# EAGLE schematic edu (EAGLE 7.6.0)

## Sheet 1 of 2
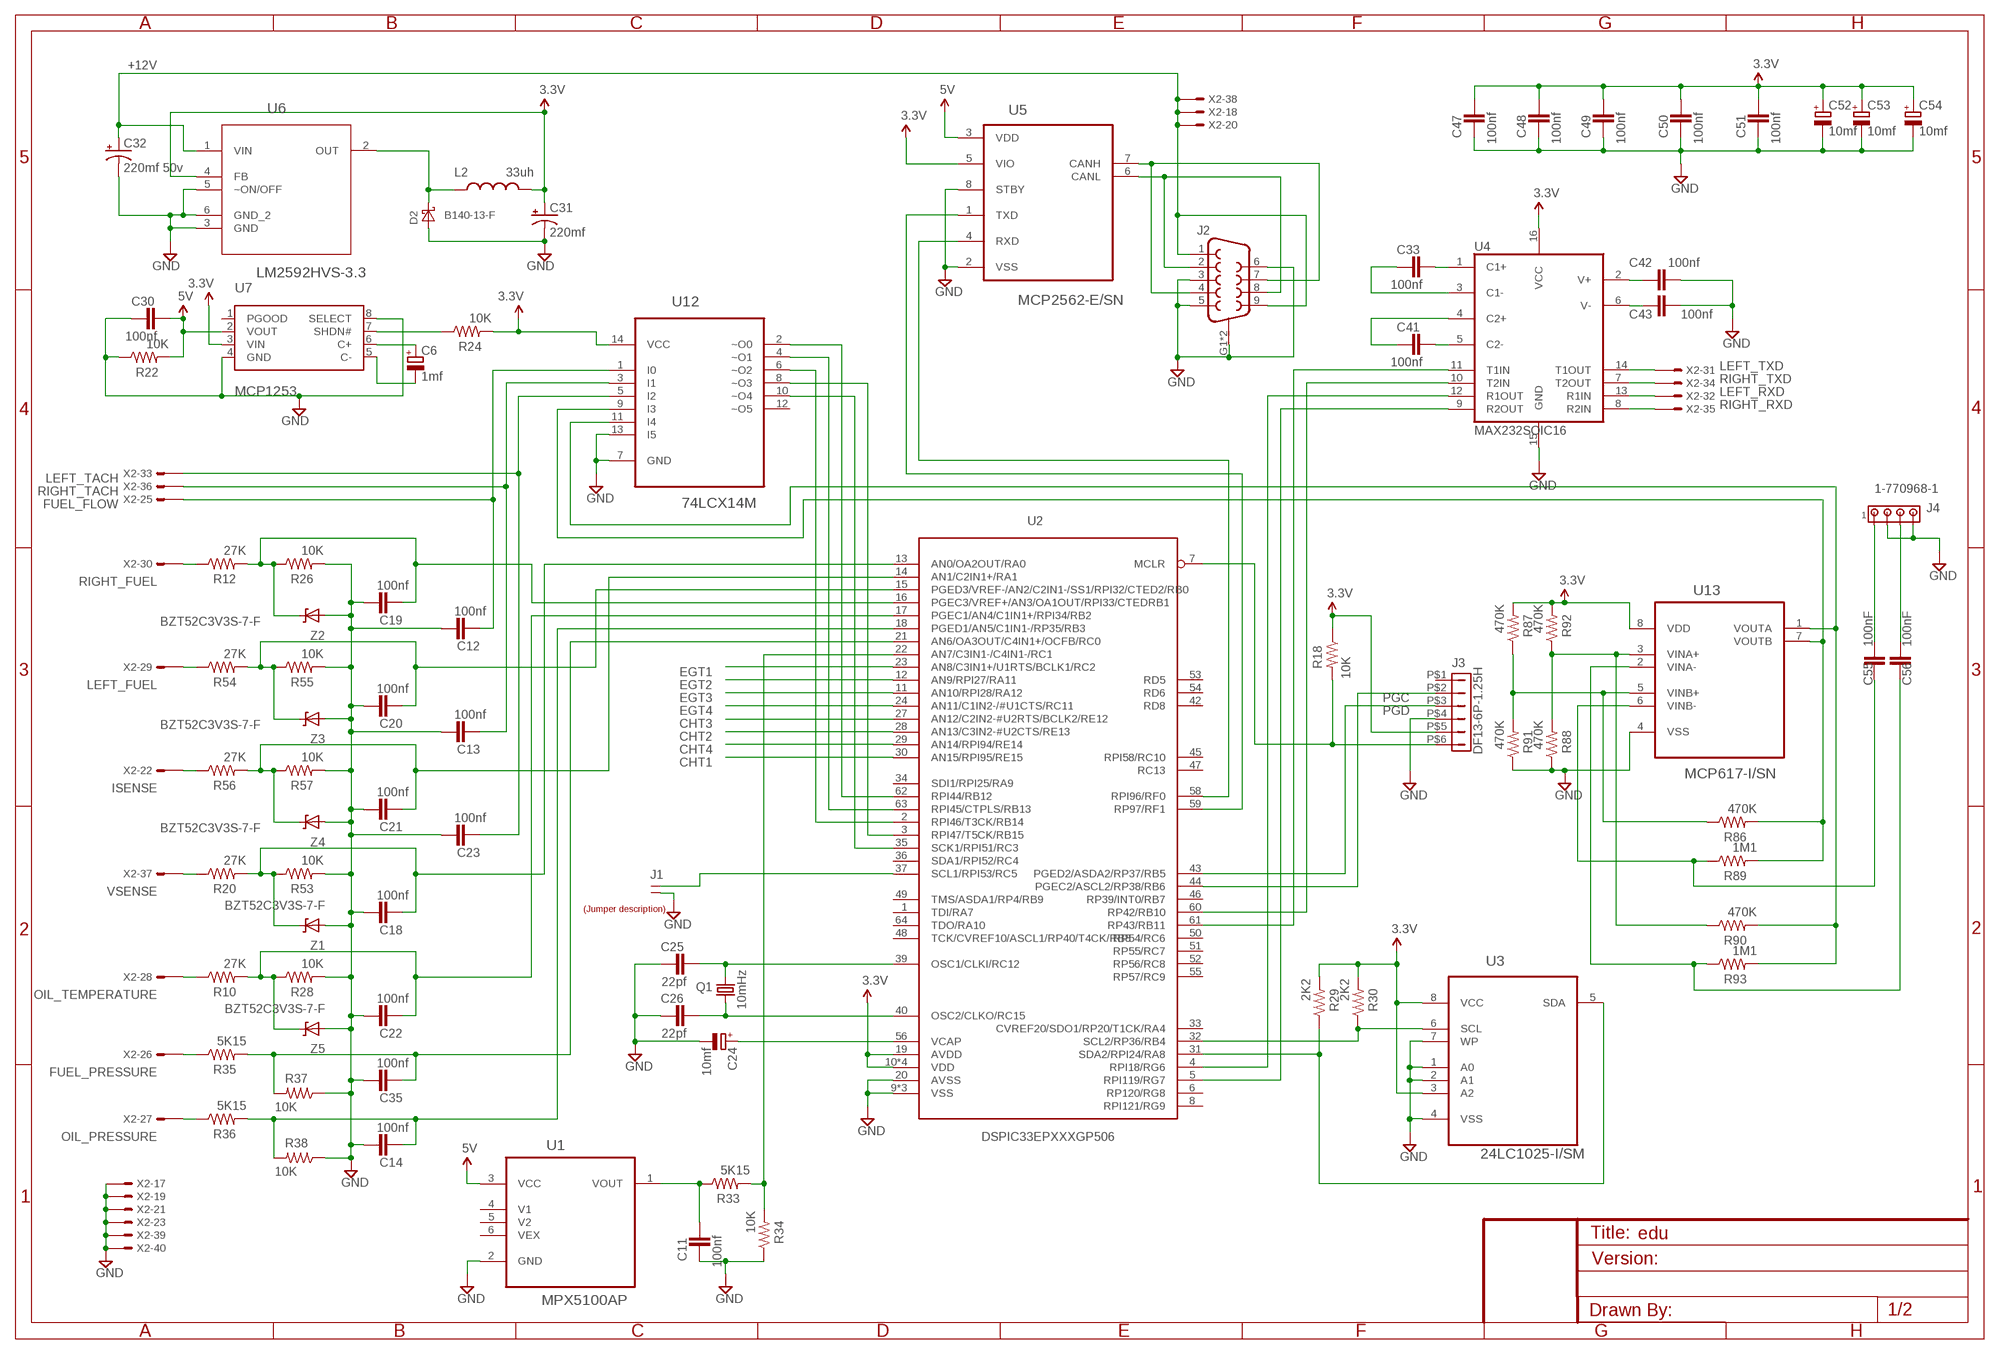
[diagram p0: schematic, sheet 1]

### Parts
C6  1mf  CAPACITOR_POL-SMC_A  [SMC_A]
C11  100nf  CAPACITOR_NPOL-0805  [C805]
C12  100nf  CAPACITOR_NPOL-0805  [C805]
C13  100nf  CAPACITOR_NPOL-0805  [C805]
C14  100nf  CAPACITOR_NPOL-0805  [C805]
C18  100nf  CAPACITOR_NPOL-0805  [C805]
C19  100nf  CAPACITOR_NPOL-0805  [C805]
C20  100nf  CAPACITOR_NPOL-0805  [C805]
C21  100nf  CAPACITOR_NPOL-0805  [C805]
C22  100nf  CAPACITOR_NPOL-0805  [C805]
C23  100nf  CAPACITOR_NPOL-0805  [C805]
C24  10mf  CAPACITOR_POL-SMC_A  [SMC_A]
C25  22pf  CAPACITOR_NPOL-0805  [C805]
C26  22pf  CAPACITOR_NPOL-0805  [C805]
C30  100nf  CAPACITOR_NPOL-0805  [C805]
C31  220mf  CAP_POL7343  [EIA7343]
C32  220mf 50v  CAP_POL7343  [EIA7343]
C33  100nf  CAPACITOR_NPOL-0805  [C805]
C35  100nf  CAPACITOR_NPOL-0805  [C805]
C41  100nf  CAPACITOR_NPOL-0805  [C805]
C42  100nf  CAPACITOR_NPOL-0805  [C805]
C43  100nf  CAPACITOR_NPOL-0805  [C805]
C47  100nf  CAPACITOR_NPOL-0805  [C805]
C48  100nf  CAPACITOR_NPOL-0805  [C805]
C49  100nf  CAPACITOR_NPOL-0805  [C805]
C50  100nf  CAPACITOR_NPOL-0805  [C805]
C51  100nf  CAPACITOR_NPOL-0805  [C805]
C52  10mf  CAPACITOR_POL-SMC_A  [SMC_A]
C53  10mf  CAPACITOR_POL-SMC_A  [SMC_A]
C54  10mf  CAPACITOR_POL-SMC_A  [SMC_A]
C55  100nF  CAP1812  [1812]
C56  100nF  CAP1812  [1812]
D2  B140-13-F  DIODE-SCHOTTKY-SMA  [SMA]
J1  M20-9770246  JUMPER-1X2  [JUMPER-1X2]
J2  DB9FEMALE  [DB9]
J3  DF13-6P-1.25H  [DF13A-6P-1.25H]
J4  1-770968-1  [1-770968-1]
L2  33uh  INDUCTOR  [1812]
Q1  10mHz  CRYSTALHC49S  [HC49/S]
R10  27K  RESISTOR0603-RES  [0603-RES]
R12  27K  RESISTOR0603-RES  [0603-RES]
R18  10K  RESISTOR0603-RES  [0603-RES]
R20  27K  RESISTOR0603-RES  [0603-RES]
R22  10K  RESISTOR0603-RES  [0603-RES]
R24  10K  RESISTOR0603-RES  [0603-RES]
R26  10K  RESISTOR0603-RES  [0603-RES]
R28  10K  RESISTOR0603-RES  [0603-RES]
R29  2K2  RESISTOR0603-RES  [0603-RES]
R30  2K2  RESISTOR0603-RES  [0603-RES]
R33  5K15  RESISTOR0603-RES  [0603-RES]
R34  10K  RESISTOR0603-RES  [0603-RES]
R35  5K15  RESISTOR0603-RES  [0603-RES]
R36  5K15  RESISTOR0603-RES  [0603-RES]
R37  10K  RESISTOR0603-RES  [0603-RES]
R38  10K  RESISTOR0603-RES  [0603-RES]
R53  10K  RESISTOR0603-RES  [0603-RES]
R54  27K  RESISTOR0603-RES  [0603-RES]
R55  10K  RESISTOR0603-RES  [0603-RES]
R56  27K  RESISTOR0603-RES  [0603-RES]
R57  10K  RESISTOR0603-RES  [0603-RES]
R86  470K  RESISTOR0603-RES  [0603-RES]
R87  470K  RESISTOR0603-RES  [0603-RES]
R88  470K  RESISTOR0603-RES  [0603-RES]
R89  1M1  RESISTOR0603-RES  [0603-RES]
R90  470K  RESISTOR0603-RES  [0603-RES]
R91  470K  RESISTOR0603-RES  [0603-RES]
R92  470K  RESISTOR0603-RES  [0603-RES]
R93  1M1  RESISTOR0603-RES  [0603-RES]
U1  MPX5100AP  [FREESCALE_CASE_867B-04]
U2  DSPIC33EPXXXGP506  [TQFP64-10X10]
U3  24LC1025-I/SM  [SOIC8-N_MC]
U4  MAX232SOIC16  [SO016]
U5  MCP2562-E/SN  [SOIC-8N]
U6  LM2592HVS-3.3  LM2592HVS-5.0  [TO170P1435X457-5N]
U7  MCP1253  [MSOP8]
U12  74LCX14M  [SOIC127P600X175-14N]
U13  MCP617-I/SN  [SOIC127P600X175-8N]
U$5  LABEL_JUMPER_1X2  [JUMP2_DESC]
X2  057-040-1  [057-040-1]
Z1  BZT52C3V3S-7-F  DIODE-ZENER-BZT52  [SOD-323]
Z2  BZT52C3V3S-7-F  DIODE-ZENER-BZT52  [SOD-323]
Z3  BZT52C3V3S-7-F  DIODE-ZENER-BZT52  [SOD-323]
Z4  BZT52C3V3S-7-F  DIODE-ZENER-BZT52  [SOD-323]
Z5  BZT52C3V3S-7-F  DIODE-ZENER-BZT52  [SOD-323]

### Nets
3.3V: C31.A(+) C47.1 C48.1 C49.1 C50.1 C51.1 C52.+ C53.+ C54.+ J3.P$5 L2.2 R18.1 R24.2 R29.2 R30.2 R87.2 R92.2 U2.10(VDD) U2.19(AVDD) U2.26(VDD) U2.38(VDD) U2.57(VDD) U3.3(A2) U3.8(VCC) U4.16(VCC) U5.5(VIO) U6.4(FB) U7.3(VIN) U12.14(VCC) U13.8(VDD) ; also sheet 2
5V: C30.1 R22.2 U1.3(VCC) U5.3(VDD) U7.2(VOUT)
!MCLR: J3.P$6 R18.2 U2.7(MCLR)
#FUEL_FLOW: U2.62(RPI44/RB12) U12.2(~O0)
#LEFT_TACH: U2.2(RPI46/T3CK/RB14) U12.6(~O2)
#RIGHT_TACH: U2.63(RPI45/CTPLS/RB13) U12.4(~O1)
+12V: C32.A(+) J2.1 J2.9 U6.1(VIN) X2.18 X2.20 X2.38
CANH: J2.4 J2.7 U5.7(CANH)
CANL: J2.2 J2.8 U5.6(CANL)
CHT1: U2.30(AN15/RPI95/RE15) ; also sheet 2
CHT2: U2.28(AN13/C3IN2-#U2CTS/RE13) ; also sheet 2
CHT3: U2.27(AN12/C2IN2-#U2RTS/BCLK2/RE12) ; also sheet 2
CHT4: U2.29(AN14/RPI94/RE14) ; also sheet 2
EGT1: U2.23(AN8/C3IN1+/U1RTS/BCLK1/RC2) ; also sheet 2
EGT2: U2.12(AN9/RPI27/RA11) ; also sheet 2
EGT3: U2.11(AN10/RPI28/RA12) ; also sheet 2
EGT4: U2.24(AN11/C1IN2-/#U1CTS/RC11) ; also sheet 2
FUEL_FLOW: C12.2 U12.1(I0) X2.25
FUEL_PRESSURE: R35.1 X2.26
GND: C11.2 C12.1 C13.1 C14.1 C18.1 C19.1 C20.1 C21.1 C22.1 C23.1 C24.- C25.2 C26.2 C30.2 C31.C(-) C32.C(-) C35.1 C42.1 C43.1 C47.2 C48.2 C49.2 C50.2 C51.2 C52.- C53.- C54.- D2.A J1.2 J2.3 J2.5 J2.6 J2.G1(SHIELD) J2.G2(SHIELD) J3.P$4 J4.P$2 J4.P$4 R22.1 R26.2 R28.2 R34.1 R37.1 R38.1 R53.2 R55.2 R57.2 R88.1 R91.1 U1.2(GND) U2.9(VSS) U2.20(AVSS) U2.25(VSS) U2.41(VSS) U3.1(A0) U3.2(A1) U3.4(VSS) U3.7(WP) U4.15(GND) U5.2(VSS) U5.8(STBY) U6.3(GND) U6.5(~ON/OFF) U6.6(GND_2) U7.4(GND) U7.8(SELECT) U12.7(GND) U12.13(I5) U13.4(VSS) X2.17 X2.19 X2.21 X2.23 X2.39 X2.40 Z1.2(A) Z2.2(A) Z3.2(A) Z4.2(A) Z5.2(A) ; also sheet 2
ISENSE: R56.1 X2.22
LEFT_FUEL: R54.1 X2.29
LEFT_RXD: U4.13(R1IN) X2.32
LEFT_TACH: C23.2 U12.5(I2) X2.33
LEFT_TXD: U4.14(T1OUT) X2.31
N$2: R24.1 U7.7(SHDN#)
N$4: C18.2 R20.2 R53.1 U2.13(AN0/OA2OUT/RA0) Z1.1(C)
N$5: C33.1 U4.1(C1+)
N$6: C33.2 U4.3(C1-)
N$7: C41.2 U4.4(C2+)
N$8: C22.2 R10.2 R28.1 U2.17(PGEC1/AN4/C1IN1+/RPI34/RB2) Z5.1(C)
N$9: C41.1 U4.5(C2-)
N$10: C42.2 U4.2(V+)
N$11: C43.2 U4.6(V-)
N$12: D2.C L2.1 U6.2(OUT)
N$13: R33.2 R34.2 U2.22(AN7/C3IN1-/C4IN1-/RC1)
N$14: C35.2 R35.2 R37.2 U2.21(AN6/OA3OUT/C4IN1+/OCFB/RC0)
N$15: C14.2 R36.2 R38.2 U2.18(PGED1/AN5/C1IN1-/RP35/RB3)
N$16: C25.1 Q1.2 U2.39(OSC1/CLKI/RC12)
N$21: C55.2 J4.P$1
N$22: C56.2 J4.P$3
N$28: R86.2 R89.2 U12.9(I3) U13.7(VOUTB)
N$29: C55.1 R89.1 U13.6(VINB-)
N$30: C56.1 R93.1 U13.2(VINA-)
N$31: C24.+ U2.56(VCAP)
N$32: R90.2 R93.2 U12.11(I4) U13.1(VOUTA)
N$33: U2.3(RPI47/T5CK/RB15) U12.8(~O3)
N$34: U2.35(SCK1/RPI51/RC3) U12.10(~O4)
N$35: J1.1 U2.37(SCL1/RPI53/RC5)
N$37: C6.- U7.5(C-)
N$38: C6.+ U7.6(C+)
N$39: R30.1 U2.32(SCL2/RP36/RB4) U3.6(SCL)
N$40: R88.2 R90.1 R92.1 U13.3(VINA+)
N$41: R29.1 U2.31(SDA2/RPI24/RA8) U3.5(SDA)
N$42: C19.2 R12.2 R26.1 U2.16(PGEC3/VREF+/AN3/OA1OUT/RPI33/CTEDRB1) Z2.1(C)
N$43: C20.2 R54.2 R55.1 U2.15(PGED3/VREF-/AN2/C2IN1-/SS1/RPI32/CTED2/RB0) Z3.1(C)
N$44: C21.2 R56.2 R57.1 U2.14(AN1/C2IN1+/RA1) Z4.1(C)
N$45: U2.59(RP97/RF1) U5.1(TXD)
N$46: U2.61(RP43/RB11) U4.11(T1IN)
N$47: U2.60(RP42/RB10) U4.10(T2IN)
N$48: U2.4(RPI18/RG6) U4.12(R1OUT)
N$49: U2.5(RPI119/RG7) U4.9(R2OUT)
N$50: U2.58(RPI96/RF0) U5.4(RXD)
N$55: C11.1 R33.1 U1.1(VOUT)
N$62: R86.1 R87.1 R91.2 U13.5(VINB+)
N$70: C26.1 Q1.1 U2.40(OSC2/CLKO/RC15)
OIL_PRESSURE: R36.1 X2.27
OIL_TEMPERATURE: R10.1 X2.28
PGC: J3.P$2 U2.44(PGEC2/ASCL2/RP38/RB6)
PGD: J3.P$3 U2.43(PGED2/ASDA2/RP37/RB5)
RIGHT_FUEL: R12.1 X2.30
RIGHT_RXD: U4.8(R2IN) X2.35
RIGHT_TACH: C13.2 U12.3(I1) X2.36
RIGHT_TXD: U4.7(T2OUT) X2.34
VSENSE: R20.1 X2.37
Unconnected: J3.P$1 U1.4(V1) U1.5(V2) U1.6(VEX) U2.1(TDI/RA7) U2.6(RP120/RG8) U2.8(RPI121/RG9) U2.33(CVREF20/SDO1/RP20/T1CK/RA4) U2.34(SDI1/RPI25/RA9) U2.36(SDA1/RPI52/RC4) U2.42(RD8) U2.45(RPI58/RC10) U2.46(RP39/INT0/RB7) U2.47(RC13) U2.48(TCK/CVREF10/ASCL1/RP40/T4CK/RB8) U2.49(TMS/ASDA1/RP4/RB9) U2.50(RP54/RC6) U2.51(RP55/RC7) U2.52(RP56/RC8) U2.53(RD5) U2.54(RD6) U2.55(RP57/RC9) U2.64(TDO/RA10) U7.1(PGOOD) U12.12(~O5) X2.24

## Sheet 2 of 2
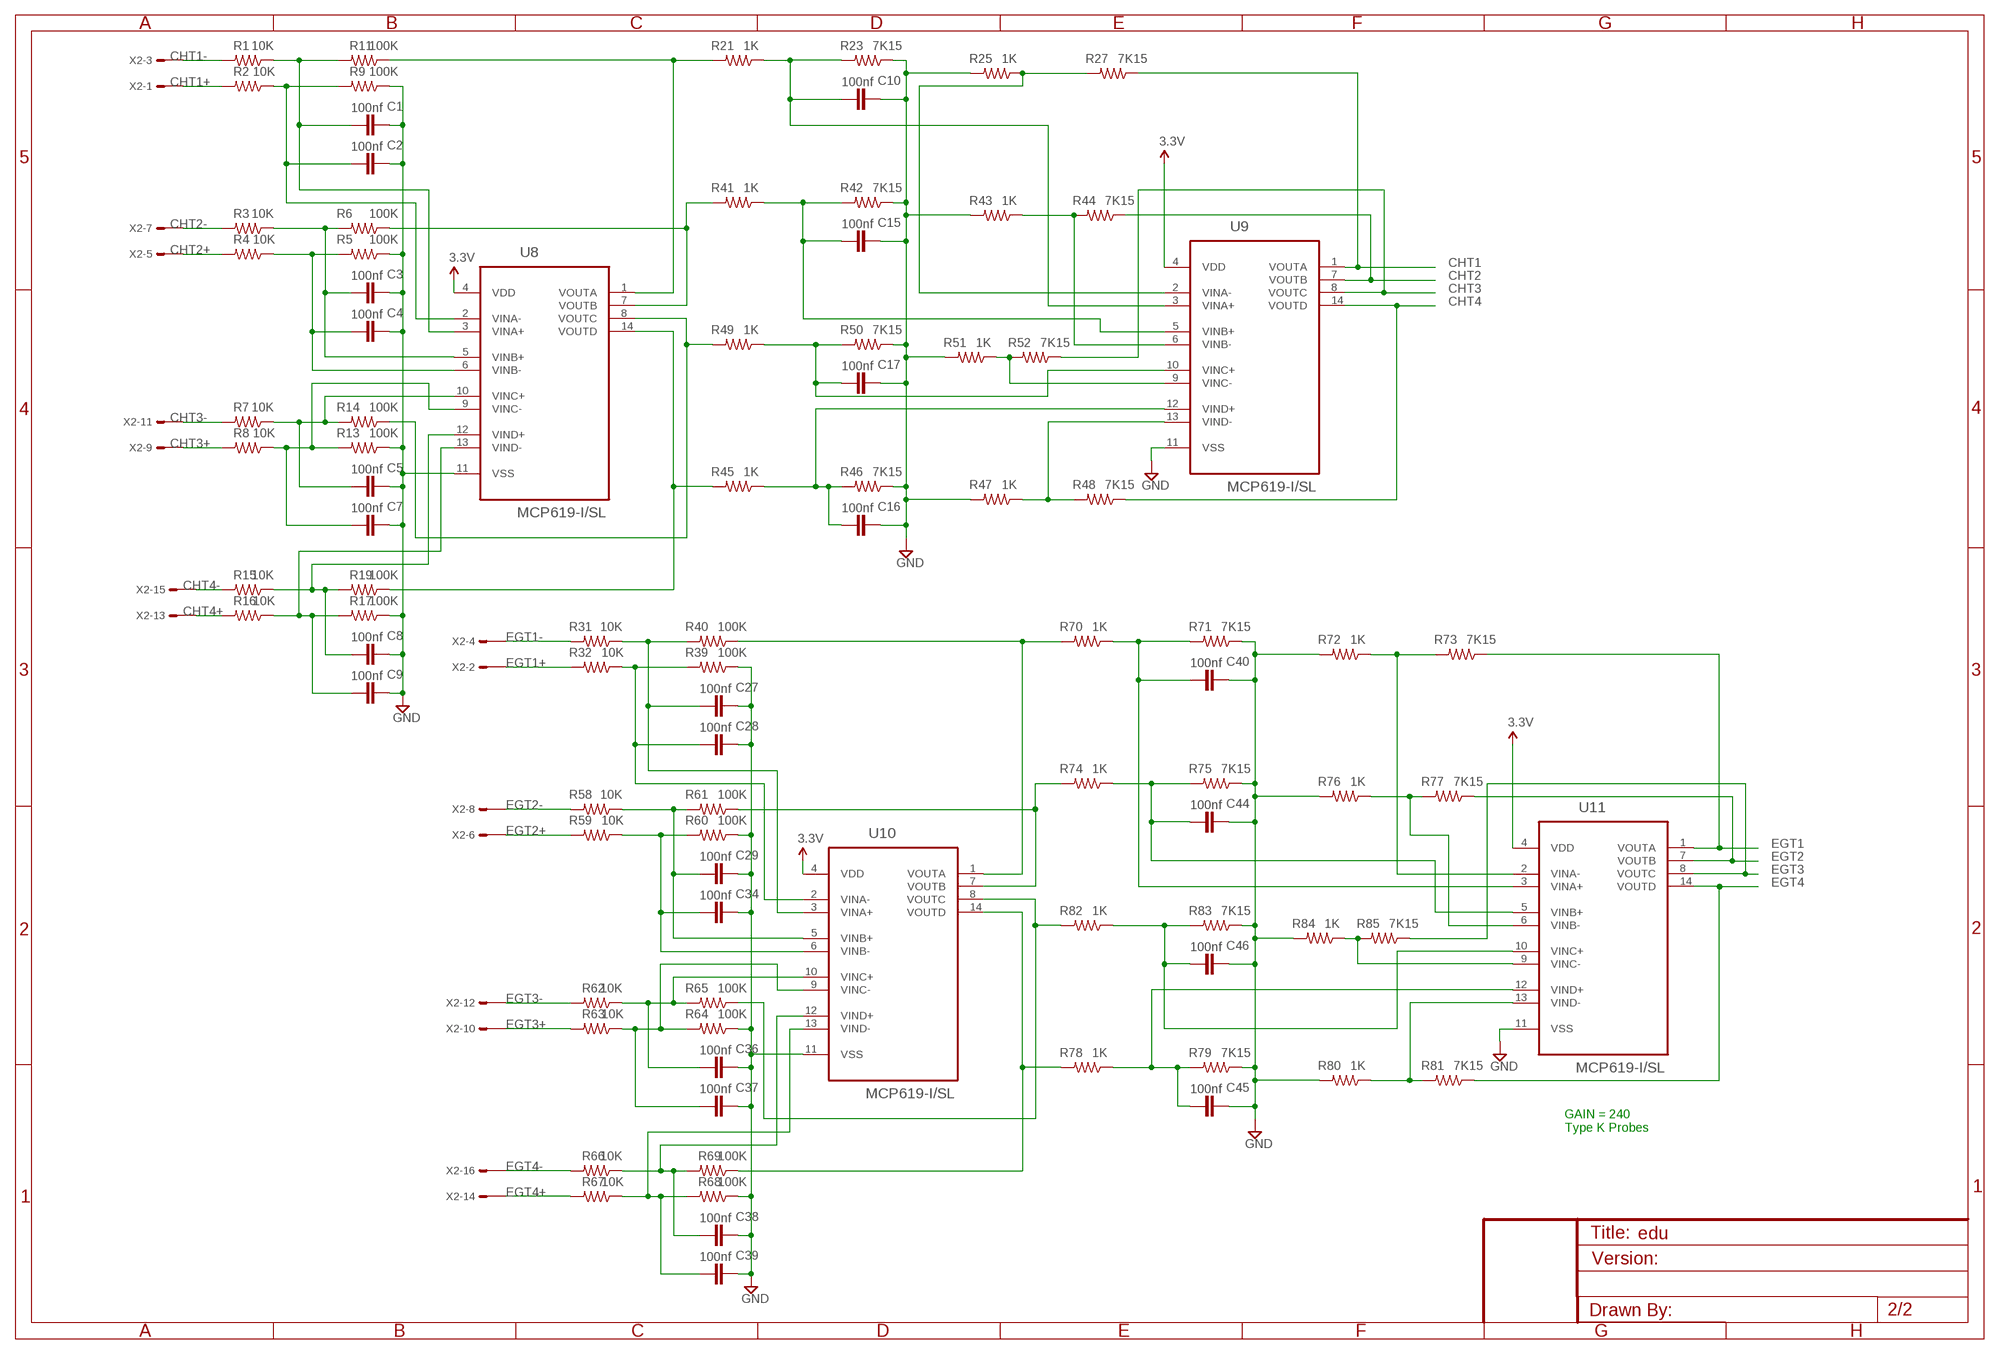
[diagram p1: schematic, sheet 2]

### Parts
C1  100nf  CAPACITOR_NPOL-0805  [C805]
C2  100nf  CAPACITOR_NPOL-0805  [C805]
C3  100nf  CAPACITOR_NPOL-0805  [C805]
C4  100nf  CAPACITOR_NPOL-0805  [C805]
C5  100nf  CAPACITOR_NPOL-0805  [C805]
C7  100nf  CAPACITOR_NPOL-0805  [C805]
C8  100nf  CAPACITOR_NPOL-0805  [C805]
C9  100nf  CAPACITOR_NPOL-0805  [C805]
C10  100nf  CAPACITOR_NPOL-0805  [C805]
C15  100nf  CAPACITOR_NPOL-0805  [C805]
C16  100nf  CAPACITOR_NPOL-0805  [C805]
C17  100nf  CAPACITOR_NPOL-0805  [C805]
C27  100nf  CAPACITOR_NPOL-0805  [C805]
C28  100nf  CAPACITOR_NPOL-0805  [C805]
C29  100nf  CAPACITOR_NPOL-0805  [C805]
C34  100nf  CAPACITOR_NPOL-0805  [C805]
C36  100nf  CAPACITOR_NPOL-0805  [C805]
C37  100nf  CAPACITOR_NPOL-0805  [C805]
C38  100nf  CAPACITOR_NPOL-0805  [C805]
C39  100nf  CAPACITOR_NPOL-0805  [C805]
C40  100nf  CAPACITOR_NPOL-0805  [C805]
C44  100nf  CAPACITOR_NPOL-0805  [C805]
C45  100nf  CAPACITOR_NPOL-0805  [C805]
C46  100nf  CAPACITOR_NPOL-0805  [C805]
R1  10K  RESISTOR0603-RES  [0603-RES]
R2  10K  RESISTOR0603-RES  [0603-RES]
R3  10K  RESISTOR0603-RES  [0603-RES]
R4  10K  RESISTOR0603-RES  [0603-RES]
R5  100K  RESISTOR0603-RES  [0603-RES]
R6  100K  RESISTOR0603-RES  [0603-RES]
R7  10K  RESISTOR0603-RES  [0603-RES]
R8  10K  RESISTOR0603-RES  [0603-RES]
R9  100K  RESISTOR0603-RES  [0603-RES]
R11  100K  RESISTOR0603-RES  [0603-RES]
R13  100K  RESISTOR0603-RES  [0603-RES]
R14  100K  RESISTOR0603-RES  [0603-RES]
R15  10K  RESISTOR0603-RES  [0603-RES]
R16  10K  RESISTOR0603-RES  [0603-RES]
R17  100K  RESISTOR0603-RES  [0603-RES]
R19  100K  RESISTOR0603-RES  [0603-RES]
R21  1K  RESISTOR0603-RES  [0603-RES]
R23  7K15  RESISTOR0603-RES  [0603-RES]
R25  1K  RESISTOR0603-RES  [0603-RES]
R27  7K15  RESISTOR0603-RES  [0603-RES]
R31  10K  RESISTOR0603-RES  [0603-RES]
R32  10K  RESISTOR0603-RES  [0603-RES]
R39  100K  RESISTOR0603-RES  [0603-RES]
R40  100K  RESISTOR0603-RES  [0603-RES]
R41  1K  RESISTOR0603-RES  [0603-RES]
R42  7K15  RESISTOR0603-RES  [0603-RES]
R43  1K  RESISTOR0603-RES  [0603-RES]
R44  7K15  RESISTOR0603-RES  [0603-RES]
R45  1K  RESISTOR0603-RES  [0603-RES]
R46  7K15  RESISTOR0603-RES  [0603-RES]
R47  1K  RESISTOR0603-RES  [0603-RES]
R48  7K15  RESISTOR0603-RES  [0603-RES]
R49  1K  RESISTOR0603-RES  [0603-RES]
R50  7K15  RESISTOR0603-RES  [0603-RES]
R51  1K  RESISTOR0603-RES  [0603-RES]
R52  7K15  RESISTOR0603-RES  [0603-RES]
R58  10K  RESISTOR0603-RES  [0603-RES]
R59  10K  RESISTOR0603-RES  [0603-RES]
R60  100K  RESISTOR0603-RES  [0603-RES]
R61  100K  RESISTOR0603-RES  [0603-RES]
R62  10K  RESISTOR0603-RES  [0603-RES]
R63  10K  RESISTOR0603-RES  [0603-RES]
R64  100K  RESISTOR0603-RES  [0603-RES]
R65  100K  RESISTOR0603-RES  [0603-RES]
R66  10K  RESISTOR0603-RES  [0603-RES]
R67  10K  RESISTOR0603-RES  [0603-RES]
R68  100K  RESISTOR0603-RES  [0603-RES]
R69  100K  RESISTOR0603-RES  [0603-RES]
R70  1K  RESISTOR0603-RES  [0603-RES]
R71  7K15  RESISTOR0603-RES  [0603-RES]
R72  1K  RESISTOR0603-RES  [0603-RES]
R73  7K15  RESISTOR0603-RES  [0603-RES]
R74  1K  RESISTOR0603-RES  [0603-RES]
R75  7K15  RESISTOR0603-RES  [0603-RES]
R76  1K  RESISTOR0603-RES  [0603-RES]
R77  7K15  RESISTOR0603-RES  [0603-RES]
R78  1K  RESISTOR0603-RES  [0603-RES]
R79  7K15  RESISTOR0603-RES  [0603-RES]
R80  1K  RESISTOR0603-RES  [0603-RES]
R81  7K15  RESISTOR0603-RES  [0603-RES]
R82  1K  RESISTOR0603-RES  [0603-RES]
R83  7K15  RESISTOR0603-RES  [0603-RES]
R84  1K  RESISTOR0603-RES  [0603-RES]
R85  7K15  RESISTOR0603-RES  [0603-RES]
U8  MCP619-I/SL  [SOIC127P600X175-14N]
U9  MCP619-I/SL  [SOIC127P600X175-14N]
U10  MCP619-I/SL  [SOIC127P600X175-14N]
U11  MCP619-I/SL  [SOIC127P600X175-14N]

### Nets
3.3V: U8.4(VDD) U9.4(VDD) U10.4(VDD) U11.4(VDD) ; also sheet 1
CHT1: R27.1 U9.1(VOUTA) ; also sheet 1
CHT1+: R2.2 X2.1
CHT1-: R1.2 X2.3
CHT1OA+: C10.1 R21.1 R23.2 U9.3(VINA+)
CHT1OA-: R25.1 R27.2 U9.2(VINA-)
CHT2: R44.1 U9.7(VOUTB) ; also sheet 1
CHT2+: R4.2 X2.5
CHT2-: R3.2 X2.7
CHT2OA+: C15.1 R41.1 R42.2 U9.5(VINB+)
CHT2OA-: R43.1 R44.2 U9.6(VINB-)
CHT3: R52.1 U9.8(VOUTC) ; also sheet 1
CHT3+: R8.2 X2.9
CHT3-: R7.2 X2.11
CHT3OA+: C17.1 R49.1 R50.2 U9.10(VINC+)
CHT3OA-: R51.1 R52.2 U9.9(VINC-)
CHT4: R48.1 U9.14(VOUTD) ; also sheet 1
CHT4+: R16.2 X2.13
CHT4+OA: C9.1 R16.1 R17.2 U8.13(VIND-)
CHT4-: R15.2 X2.15
CHT4-OA: C8.1 R15.1 R19.2 U8.12(VIND+)
CHT4OA+: C16.1 R45.1 R46.2 U9.12(VIND+)
CHT4OA-: R47.1 R48.2 U9.13(VIND-)
EGT1: R73.1 U11.1(VOUTA) ; also sheet 1
EGT1+: R32.2 X2.2
EGT1-: R31.2 X2.4
EGT1OA+: C40.1 R70.1 R71.2 U11.3(VINA+)
EGT1OA-: R72.1 R73.2 U11.2(VINA-)
EGT2: R77.1 U11.7(VOUTB) ; also sheet 1
EGT2+: R59.2 X2.6
EGT2-: R58.2 X2.8
EGT2OA+: C44.1 R74.1 R75.2 U11.5(VINB+)
EGT2OA-: R76.1 R77.2 U11.6(VINB-)
EGT3: R85.1 U11.8(VOUTC) ; also sheet 1
EGT3+: R63.2 X2.10
EGT3-: R62.2 X2.12
EGT3OA+: C46.1 R82.1 R83.2 U11.10(VINC+)
EGT3OA-: R84.1 R85.2 U11.9(VINC-)
EGT4: R81.1 U11.14(VOUTD) ; also sheet 1
EGT4+: R67.2 X2.14
EGT4-: R66.2 X2.16
EGT4OA+: C45.1 R78.1 R79.2 U11.12(VIND+)
EGT4OA-: R80.1 R81.2 U11.13(VIND-)
GND: C1.2 C2.2 C3.2 C4.2 C5.2 C7.2 C8.2 C9.2 C10.2 C15.2 C16.2 C17.2 C27.2 C28.2 C29.2 C34.2 C36.2 C37.2 C38.2 C39.2 C40.2 C44.2 C45.2 C46.2 R5.1 R9.1 R13.1 R17.1 R23.1 R25.2 R39.1 R42.1 R43.2 R46.1 R47.2 R50.1 R51.2 R60.1 R64.1 R68.1 R71.1 R72.2 R75.1 R76.2 R79.1 R80.2 R83.1 R84.2 U8.11(VSS) U9.11(VSS) U10.11(VSS) U11.11(VSS) ; also sheet 1
N$1: C1.1 R1.1 R11.2 U8.3(VINA+)
N$3: C2.1 R2.1 R9.2 U8.2(VINA-)
N$17: R11.1 R21.2 U8.1(VOUTA)
N$18: C3.1 R3.1 R6.2 U8.5(VINB+)
N$19: C4.1 R4.1 R5.2 U8.6(VINB-)
N$20: C7.1 R8.1 R13.2 U8.9(VINC-)
N$23: R6.1 R41.2 U8.7(VOUTB)
N$24: R14.1 R49.2 U8.8(VOUTC)
N$25: C5.1 R7.1 R14.2 U8.10(VINC+)
N$26: R19.1 R45.2 U8.14(VOUTD)
N$27: C27.1 R31.1 R40.2 U10.3(VINA+)
N$51: C28.1 R32.1 R39.2 U10.2(VINA-)
N$52: C29.1 R58.1 R61.2 U10.5(VINB+)
N$53: C34.1 R59.1 R60.2 U10.6(VINB-)
N$54: C38.1 R66.1 R69.2 U10.12(VIND+)
N$56: C36.1 R62.1 R65.2 U10.10(VINC+)
N$57: C37.1 R63.1 R64.2 U10.9(VINC-)
N$58: C39.1 R67.1 R68.2 U10.13(VIND-)
N$59: R40.1 R70.2 U10.1(VOUTA)
N$60: R61.1 R74.2 U10.7(VOUTB)
N$61: R65.1 R82.2 U10.8(VOUTC)
N$71: R69.1 R78.2 U10.14(VOUTD)

### Notes on the sheet
- GAIN = 240
  Type K Probes

## Library data of the parts
C1-C5 C7-C23 C27-C30 C33-C51 = dp_devices:CAPACITOR_NPOL: Non-Polarized capacitor in various packages; PARTNO: CL21F104ZBCNNNC
C6 = dp_devices:CAPACITOR_POL: Polarized capacitor in various packages; PARTNO: F931C105MAA
C24 C52-C54 = dp_devices:CAPACITOR_POL: Polarized capacitor in various packages; PARTNO: T491A106K004AT
C25 C26 = dp_devices:CAPACITOR_NPOL: Non-Polarized capacitor in various packages; PARTNO: C0805C220J5GACTU
C31 C32 = SparkFun:CAP_POL: Capacitor Polarized These are standard SMD and PTH capacitors. Normally 10uF, 47uF, and 100uF in electrolytic and tantalum varieties. Always verify the external diameter of the through hole cap, it varies with capacity, voltage, and manufacturer. The EIA devices should be standard.; PARTNO: T545X227M016ATE035
C55 C56 = SparkFun:CAP: Capacitor Standard 0603 ceramic capacitor, and 0.1" leaded capacitor.; PARTNO: CL21F104ZBCNNNC
D2 = diode2:DIODE-SCHOTTKY-: SCHOTTKY DIODE; PARTNO: B140-13-F
J1 = QuantumOptics:JUMPER-1X2: Jumper, header, SIP on 0.1" grid, for option selection.; PARTNO: M20-9770246
J2 = 15pinD:DB9: DB9 Connector Standard DB9 (D-Sub 9) serial connector. Can be used for CAN bus as well as RS485 and RS232. Footprint production proven. Spark Fun Electronics SKU : PRT-00429; PARTNO: 1734354-2; PROD_ID: CONN-08194
J3 = con-hirose-df13:DF13-6P-1.25: DF13-6P 1.25mm Pitch Miniature Crimping Connector.; PARTNO: DF13A-6P-1.25H(20)
J4 = con-amp:1-770968-1; PARTNO: 1-770968-1
L2 = SparkFun:INDUCTOR: Inductors Basic Inductor/Choke - 0603 and 1206. Footprints are not proven and vary greatly between part numbers.; PARTNO: LQH43MN330K03L
Q1 = crystal:CRYSTAL: CRYSTAL; OC_FARNELL: 1667008; OC_NEWARK: unknown; PARTNO: ATS100B-E
R1-R4 R7 R8 R15 R16 R18 R22 R24 R26 R28 R31 R32 R34 R37 R38 R53 R55 R57-R59 R62 R63 R66 R67 = SparkFun-Passives:RESISTOR: Resistor Basic schematic elements and footprints for 0603, 1206, and PTH resistors.; PARTNO: RC0603FR-0710KL
R5 R6 R9 R11 R13 R14 R17 R19 R39 R40 R60 R61 R64 R65 R68 R69 = SparkFun-Passives:RESISTOR: Resistor Basic schematic elements and footprints for 0603, 1206, and PTH resistors.; PARTNO: RC0603FR-07100KL
R10 R12 R20 R54 R56 = SparkFun-Passives:RESISTOR: Resistor Basic schematic elements and footprints for 0603, 1206, and PTH resistors.; PARTNO: RC0603FR-0727KL
R21 R25 R41 R43 R45 R47 R49 R51 R70 R72 R74 R76 R78 R80 R82 R84 = SparkFun-Passives:RESISTOR: Resistor Basic schematic elements and footprints for 0603, 1206, and PTH resistors.; PARTNO: RC0603FR-071KL
R23 R27 R42 R44 R46 R48 R50 R52 R71 R73 R75 R77 R79 R81 R83 R85 = SparkFun-Passives:RESISTOR: Resistor Basic schematic elements and footprints for 0603, 1206, and PTH resistors.; PARTNO: RC0603FR-077K15L
R29 R30 = SparkFun-Passives:RESISTOR: Resistor Basic schematic elements and footprints for 0603, 1206, and PTH resistors.; PARTNO: RC0603FR-072K2L
R33 R35 R36 = SparkFun-Passives:RESISTOR: Resistor Basic schematic elements and footprints for 0603, 1206, and PTH resistors.; PARTNO: RC0603FR-075K23L
R86-R88 R90-R92 = SparkFun-Passives:RESISTOR: Resistor Basic schematic elements and footprints for 0603, 1206, and PTH resistors.; PARTNO: RC0603FR-07470KL
R89 R93 = SparkFun-Passives:RESISTOR: Resistor Basic schematic elements and footprints for 0603, 1206, and PTH resistors.; PARTNO: RC0603FR-071M1L
U1 = MPX5100AP:MPX5100AP: IC, PRESSURE SENSOR, 0 TO 100KPA, SIP-6; MPN: MPX5100AP; OC_FARNELL: 1457156; OC_NEWARK: 07F9928; PACKAGE: CASE 867B-04; SUPPLIER: FREESCALE SEMICONDUCTOR
U2 = microchip-dspic:DSPIC33EPXXXGP506; PARTNO: DSPIC33EP512GP506-I/PT
U3 = Microchip_By_element14_Batch_1:24LC1025-I/SM: 1024K I2C CMOS Serial EEPROM; PARTNO: 24LC1025-I/P
U4 = SparkFun:MAX232: RS232 Transceiver Very common IC. This is generically called 'MAX232', but works with the 3V equivalent MAX3232 generic ICs. Field tested and mother approved. Spark Fun Electronics SKU : COM-00316 (DIP) and COM-00589 (SMD); PARTNO: MAX3232ECDR
U5 = Microchip-MCP2562-E_SN:MCP2562-E/SN: High-Speed CAN Transceiver,SOIC-8; PARTNO: MCP2562-E/SN
U6 = NSC_By_element14_Batch_1.1:LM2592HVS-5.0: SIMPLE SWITCHER; MPN: LM2592HVS-5.0; OC_FARNELL: -; OC_NEWARK: 41K3791; PACKAGE: TO-263-5; PARTNO: LM2592HVSX-3.3/NOPB; SUPPLIER: National Semiconductor
U7 = microchip-dspic:MCP1253: Positive-Regulated Charge Pump (3.3x5.0); PARTNO: MCP1253-33X50I/MS
U8-U11 = Microchip_By_element14_Batch_1:MCP619-I/SL: Op Amp; DESCRIPTION: OP AMP; MPN: MCP619-I/SL; OC_FARNELL: 1439437; OC_NEWARK: 58M8952; PACKAGE: SOIC-14; SUPPLIER: Microchip
U12 = Fairchild_By_element14_Batch_1:74LCX14M: Low Voltage Hex Inverter; MPN: 74LCX14M; OC_FARNELL: 1013778; OC_NEWARK: 78K6290; PACKAGE: SOIC-14; PARTNO: 74LCX14MX; SUPPLIER: Fairchild
U13 = Microchip_By_element14_Batch_1:MCP617-I/SN: Op Amp; DESCRIPTION: OP AMP; MPN: MCP617-I/SN; OC_FARNELL: 1439433; OC_NEWARK: 58M8948; PACKAGE: SOIC-8; SUPPLIER: Microchip
U$5 = dp_devices:LABEL_JUMPER_1X2: Nice formatted two legged jumperdescription Use attributes to change the values ON = With jumper OFF = Without jumper; OFF: Normal; ON: Reset
X2 = con-panduit-changed:057-040-: CONNECTOR 40-pin series 057 contact pc board low profile headers; MF: SBH11-PBPC-D20-ST-BK; OC_FARNELL: unknown; OC_NEWARK: unknown; PARTNO: SBH11-PBPC-D20-ST-BK
Z1-Z5 = SparkFun:DIODE-ZENER: Zener Diode Production Part - 8199 3.4V Zener Voltage; PARTNO: BZT52C3V3S-7-F

## Net classes
0 default: width 0.152 mm, drill 0.305 mm, clearance 0.152 mm
1 8v: width 0.152 mm, drill 0.305 mm, clearance 0.152 mm
2 12v: width 0.152 mm, drill 0.305 mm, clearance 0.305 mm